# Altium schematic sheet s1.SchDoc
size A
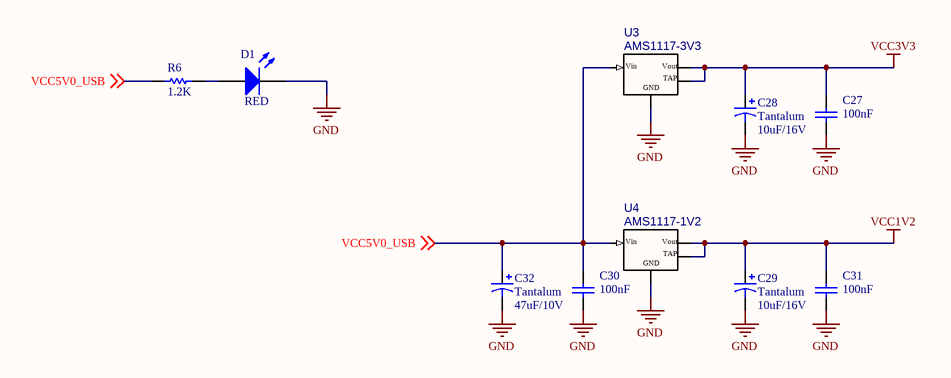
[diagram p0: s1.SchDoc]

## Parts
C27  value 100nF  [0805 CAP]  (hidden comment: Cap)
C28  Tantalum  value 10uF/16V  [CT1206_TANTALUM-SMD-10UF-20V-20%(1206)(Primary)]
C29  Tantalum  value 10uF/16V  [CT1206_TANTALUM-SMD-10UF-20V-20%(1206)(Primary)]
C30  value 100nF  [0805 CAP]  (hidden comment: Cap)
C31  value 100nF  [0805 CAP]  (hidden comment: Cap)
C32  Tantalum  value 47uF/10V  [CT1206_TANTALUM-SMD-10UF-20V-20%(1206)(Primary)]
D1  RED  [0805 LED]
R6  1.2K  [0805 RES]
U3  AMS1117-3V3  [AMS1117_AMS1117(Primary)]
U4  AMS1117-1V2  [AMS1117_AMS1117(Primary)]

## Nets
GND: C27.1 C28.2 C29.2 C30.1 C31.1 C32.2 D1.2(K) U3.GND(ADJ-GND) U4.GND(ADJ-GND)
VCC1V2: C29.1 C31.2 U4.HEATSINK U4.VOUT
VCC3V3: C27.2 C28.1 U3.HEATSINK U3.VOUT
VCC5V0_USB: C30.2 C32.1 R6.1 U3.VIN U4.VIN ; off-sheet VCC5V0_USB
NetD1_1: D1.1(A) R6.2

## Notes on the sheet
- (in symbol AMS1117) Vin; Vout; TAP

## Library data of the parts
C27 C30 C31 = Cap: Capacitor; Published: 8-Jun-2000; LatestRevisionDate: 17-Jul-2002; LatestRevisionNote: Re-released for DXP Platform.; PackageReference: RAD-0.3; Publisher: Altium Limited; PackageDescription: Radial Cap, Thru-Hole; 2 Leads; 0.3 in Pin Spacing
C28 C29 C32 = Cap Pol3: Polarized Capacitor (Surface Mount); Published: 8-Jun-2000; LatestRevisionDate: 29-May-2009; LatestRevisionNote: IPC-7351 Footprint Added.; PackageReference: C0805; Publisher: Altium Limited; PackageDescription: Chip Capacitor
D1 = LED0: Typical INFRARED GaAs LED; Published: 8-Jun-2000; LatestRevisionDate: 08-Jul-2005; LatestRevisionNote: Mech Layer 1 removed.; PackageReference: LED-0; Publisher: Altium Limited; PackageDescription: LED; 2 Leads
R6 = Res1: Resistor; Published: 8-Jun-2000; LatestRevisionDate: 17-Jul-2002; LatestRevisionNote: Re-released for DXP Platform.; PackageReference: AXIAL-0.3; Publisher: Altium Limited; PackageDescription: Axial Device, Thru-Hole; 2 Leads; 0.3 in Pin Spacing; Value: 1.2K
U3 U4 = AMS1117: Integrated Circuit; MF: Advanced Monolithic Systems; Package: UFQFN-24 Advanced Monolithic Systems; Availability: Unavailable; MP: AMS1117; Price: None; Value: *